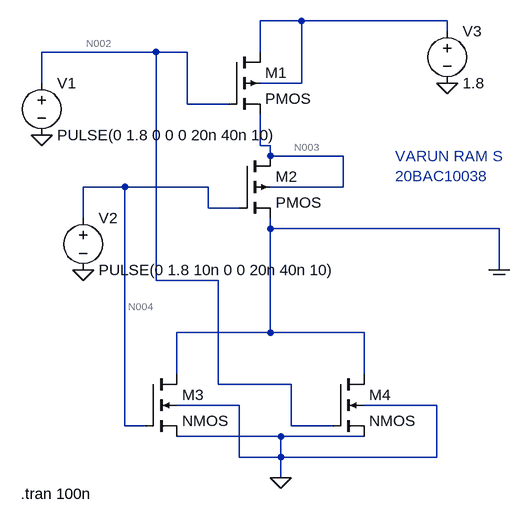
[diagram p0: schematic ECE3006_Exp7_10032023.asc]
ECE3006_Exp7_10032023.asc, the LTspice schematic file:
Version 4
SHEET 1 880 744
WIRE 256 0 192 0
WIRE 480 0 256 0
WIRE 480 16 480 0
WIRE 32 48 -144 48
WIRE 80 48 32 48
WIRE 192 48 192 0
WIRE -144 96 -144 48
WIRE 256 96 256 0
WIRE 256 96 192 96
WIRE 80 128 80 48
WIRE 144 128 80 128
WIRE 192 192 192 144
WIRE 208 192 192 192
WIRE 208 208 208 192
WIRE 320 208 208 208
WIRE -16 256 -80 256
WIRE 112 256 -16 256
WIRE 320 256 320 208
WIRE 320 256 208 256
WIRE 112 288 112 256
WIRE 160 288 112 288
WIRE -80 304 -80 256
WIRE 208 320 208 304
WIRE 560 320 208 320
WIRE 560 384 560 320
WIRE 32 400 32 48
WIRE 128 400 32 400
WIRE 208 480 208 320
WIRE 208 480 64 480
WIRE 352 480 208 480
WIRE 64 544 64 480
WIRE 352 544 352 480
WIRE 128 560 128 400
WIRE 240 560 128 560
WIRE 160 592 64 592
WIRE 464 592 352 592
WIRE -16 624 -16 256
WIRE 16 624 -16 624
WIRE 240 624 240 560
WIRE 304 624 240 624
WIRE 224 640 64 640
WIRE 352 640 224 640
WIRE 160 672 160 592
WIRE 224 672 224 640
WIRE 224 672 160 672
WIRE 464 672 464 592
WIRE 464 672 224 672
WIRE 224 704 224 672
FLAG 224 704 0
FLAG -144 176 0
FLAG -80 384 0
FLAG 480 96 0
FLAG 560 384 COM
IOPIN 560 384 Out
SYMBOL pmos4 144 48 R0
SYMATTR InstName M1
SYMATTR Value2 l=180n w=4u
SYMBOL pmos4 160 208 R0
SYMATTR InstName M2
SYMATTR Value2 l=180n w=4u
SYMBOL nmos4 16 544 R0
SYMATTR InstName M3
SYMATTR Value2 l=180n w=1u
SYMBOL nmos4 304 544 R0
SYMATTR InstName M4
SYMATTR Value2 l=180n w=1u
SYMBOL voltage -144 80 R0
WINDOW 123 0 0 Left 0
WINDOW 39 0 0 Left 0
SYMATTR InstName V1
SYMATTR Value PULSE(0 1.8 0 0 0 20n 40n 10)
SYMBOL voltage -80 288 R0
WINDOW 123 0 0 Left 0
WINDOW 39 0 0 Left 0
SYMATTR InstName V2
SYMATTR Value PULSE(0 1.8 10n 0 0 20n 40n 10)
SYMBOL voltage 480 0 R0
WINDOW 123 0 0 Left 0
WINDOW 39 0 0 Left 0
SYMATTR InstName V3
SYMATTR Value 1.8
TEXT -176 728 Left 2 !.tran 100n
TEXT 400 208 Left 2 ;VARUN RAM S\n20BAC10038

The netlist it stands for:
* ECE3006_Exp7_10032023.asc
M1 N001 N002 N003 N001 PMOS l=180n w=4u
M2 N003 N004 COM N003 PMOS l=180n w=4u
M3 COM N004 0 0 NMOS l=180n w=1u
M4 COM N002 0 0 NMOS l=180n w=1u
V1 N002 0 PULSE(0 1.8 0 0 0 20n 40n 10)
V2 N004 0 PULSE(0 1.8 10n 0 0 20n 40n 10)
V3 N001 0 1.8
.model NMOS NMOS
.model PMOS PMOS
.lib standard.mos
.tran 100n
* VARUN RAM S
* 20BAC10038
.backanno
.end

* Results of the author's LTspice run, read from the files saved beside the schematic
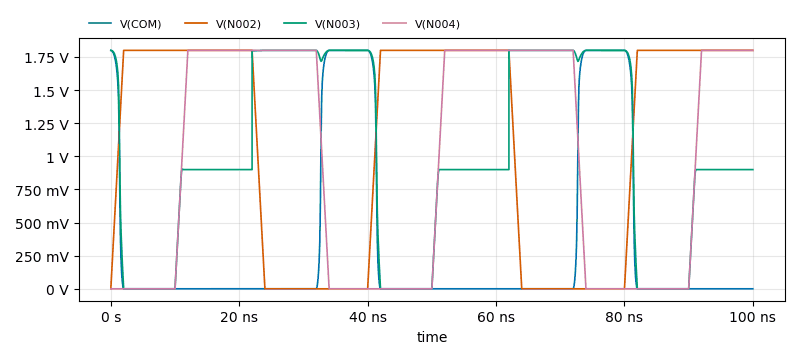
[diagram p1: Transient Analysis of ECE3006_Exp7_10032023.asc, plotted from the saved traces]
* Transient Analysis, 1 run:
*   V(COM): min 0 V, max 1.8 V, average 333.8 mV, rms 760.3 mV, last 0 V
*   V(N002): min 0 V, max 1.8 V, average 1.134 V, rms 1.417 V, last 1.8 V
*   V(N003): min 127.4 µV, max 1.8 V, average 1.016 V, rms 1.243 V, last 900 mV
*   V(N004): min 0 V, max 1.8 V, average 954 mV, rms 1.292 V, last 1.8 V